# EAGLE design ArduinoMicroShield1.0v (EAGLE 7.2.0)
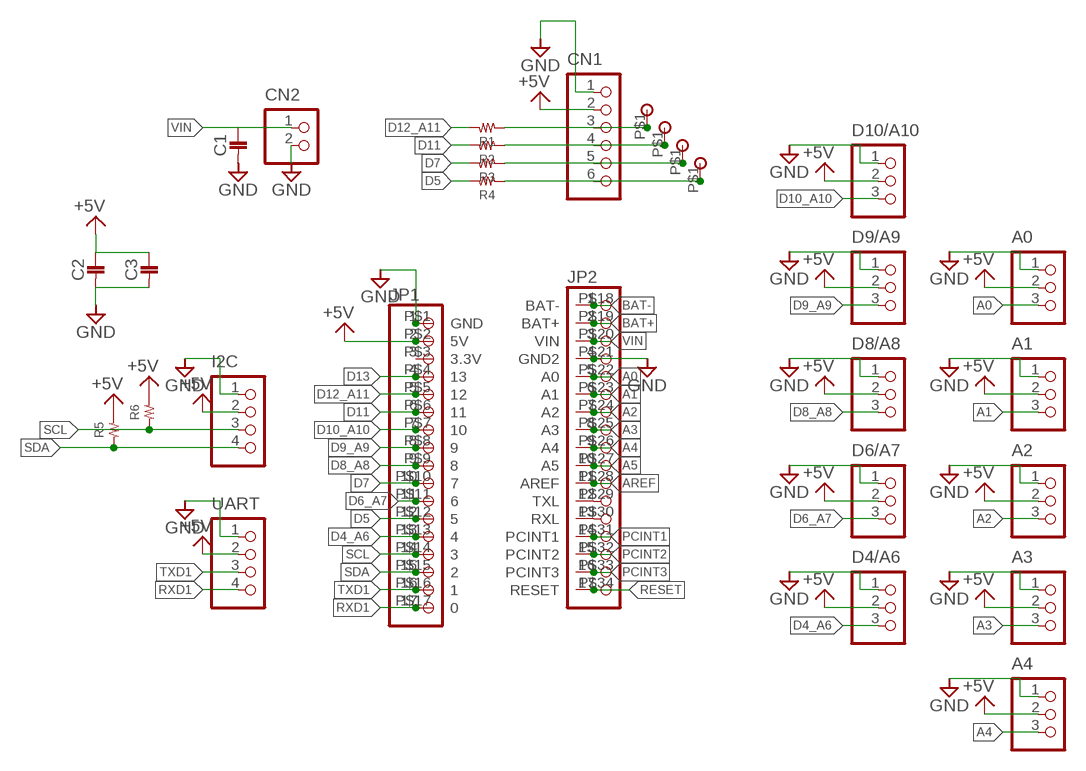
[diagram p0: schematic, sheet 1]

## Parts
A0  B3B-PH-K-S  [B3B-PH-K-S]
A1  B3B-PH-K-S  [B3B-PH-K-S]
A2  B3B-PH-K-S  [B3B-PH-K-S]
A3  B3B-PH-K-S  [B3B-PH-K-S]
A4  B3B-PH-K-S  [B3B-PH-K-S]
C1  1608  [1608]
C2  1608  [1608]
C3  1608  [1608]
CN1  B6B-PH-K-S  [B6B-PH-K-S]
CN2  S2B-PH-K-S  [S2B-PH-K-S]
D4/A6  B3B-PH-K-S  [B3B-PH-K-S]
D6/A7  B3B-PH-K-S  [B3B-PH-K-S]
D8/A8  B3B-PH-K-S  [B3B-PH-K-S]
D9/A9  B3B-PH-K-S  [B3B-PH-K-S]
D10/A10  B3B-PH-K-S  [B3B-PH-K-S]
I2C  B4B-PH-K-S  [B4B-PH-K-S]
JP1  PINHD-1X17  [1X17]
JP2  PINHD-1X17  [1X17]
R1  RESISTOR__SMD  [1608]
R2  RESISTOR__SMD  [1608]
R3  RESISTOR__SMD  [1608]
R4  RESISTOR__SMD  [1608]
R5  RESISTOR__SMD  [1608]
R6  RESISTOR__SMD  [1608]
U$1  ARDUINO_ASTAR_MICRO  [ARDUINO_ASTAR_MICRO]
U$31  CHECK_0.8MM  [CHECK_0.8MM]
U$32  CHECK_0.8MM  [CHECK_0.8MM]
U$36  CHECK_0.8MM  [CHECK_0.8MM]
U$37  CHECK_0.8MM  [CHECK_0.8MM]
UART  B4B-PH-K-S  [B4B-PH-K-S]

## Nets
+5V: A0.2 A1.2 A2.2 A3.2 A4.2 C2.P$1 C3.P$1 CN1.2 D4/A6.2 D6/A7.2 D8/A8.2 D9/A9.2 D10/A10.2 I2C.2 JP1.2 R5.2 R6.2 U$1.P$2(5V) UART.2
A0: A0.3 JP2.5 U$1.P$22(A0)
A1: A1.3 JP2.6 U$1.P$23(A1)
A2: A2.3 JP2.7 U$1.P$24(A2)
A3: A3.3 JP2.8 U$1.P$25(A3)
A4: A4.3 JP2.9 U$1.P$26(A4)
A5: JP2.10 U$1.P$27(A5)
AREF: JP2.11 U$1.P$28(AREF)
BAT+: JP2.2 U$1.P$19(BAT+)
BAT-: JP2.1 U$1.P$18(BAT-)
D4_A6: D4/A6.3 JP1.13 U$1.P$13
D5: JP1.12 R4.2 U$1.P$12
D6_A7: D6/A7.3 JP1.11 U$1.P$11
D7: JP1.10 R3.2 U$1.P$10
D8_A8: D8/A8.3 JP1.9 U$1.P$9
D9_A9: D9/A9.3 JP1.8 U$1.P$8
D10_A10: D10/A10.3 JP1.7 U$1.P$7
D11: JP1.6 R2.2 U$1.P$6
D12_A11: JP1.5 R1.2 U$1.P$5
D13: JP1.4 U$1.P$4
GND: A0.1 A1.1 A2.1 A3.1 A4.1 C1.P$2 C2.P$2 C3.P$2 CN1.1 CN2.2 D4/A6.1 D6/A7.1 D8/A8.1 D9/A9.1 D10/A10.1 I2C.1 JP1.1 JP2.4 U$1.P$1(GND) U$1.P$21(GND2) UART.1
N$1: CN1.6 R4.1 U$37.P$1
N$2: CN1.5 R3.1 U$36.P$1
N$3: CN1.4 R2.1 U$32.P$1
N$4: CN1.3 R1.1 U$31.P$1
N$5: JP1.3 U$1.P$3(3.3V)
N$6: JP2.12 U$1.P$29(TXL)
N$7: JP2.13 U$1.P$30(RXL)
PCINT1: JP2.14 U$1.P$31(PCINT1)
PCINT2: JP2.15 U$1.P$32(PCINT2)
PCINT3: JP2.16 U$1.P$33(PCINT3)
RESET: JP2.17 U$1.P$34(RESET)
RXD1: JP1.17 U$1.P$17 UART.4
SCL: I2C.3 JP1.14 R6.1 U$1.P$14
SDA: I2C.4 JP1.15 R5.1 U$1.P$15
TXD1: JP1.16 U$1.P$16 UART.3
VIN: C1.P$1 CN2.1 JP2.3 U$1.P$20(VIN)

## Library data of the parts
A0 A1-A4 D4/A6 D6/A7 D8/A8 D9/A9 D10/A10 = jst-ph:B3B-PH-*: Wire-to-Board 2.0mm pitch top mount connector Source: http://www.jst-mfg.com/product/pdf/jpn/PH.pdf http://www.jst-mfg.com/product/detail.php?series=199
C1-C3 = 02_C:1608
CN1 = jst-ph:B6B-PH-*: Wire-to-Board 2.0mm pitch top mount connector Source: http://www.jst-mfg.com/product/pdf/jpn/PH.pdf http://www.jst-mfg.com/product/detail.php?series=199
CN2 = jst-ph:S2B-PH-*: Wire-to-Board 2.0mm pitch side mount connector Source: http://www.jst-mfg.com/product/pdf/jpn/PH.pdf http://www.jst-mfg.com/product/detail.php?series=199
I2C UART = jst-ph:B4B-PH-*: Wire-to-Board 2.0mm pitch top mount connector Source: http://www.jst-mfg.com/product/pdf/jpn/PH.pdf http://www.jst-mfg.com/product/detail.php?series=199
JP1 JP2 = pinhead:PINHD-1X17: PIN HEADER
R1-R6 = 01_R:RESISTOR__SMD
U$1 = 04_IC:ARDUINO_ASTAR_MICRO
U$31 U$32 U$36 U$37 = 08_CONECTOR:CHECK_0.8MM

## Board
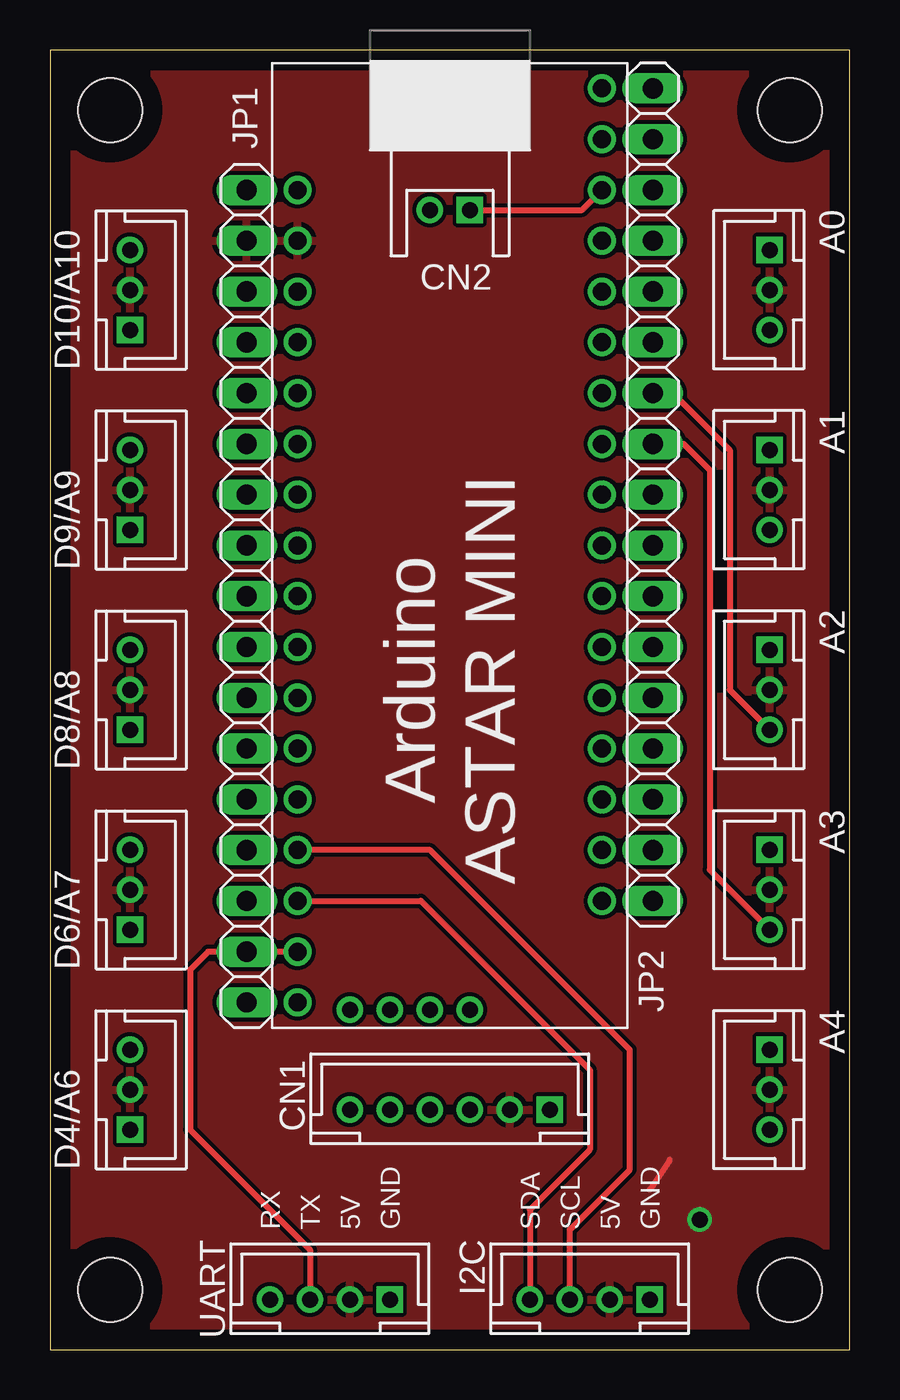
[diagram p1: board, top side]
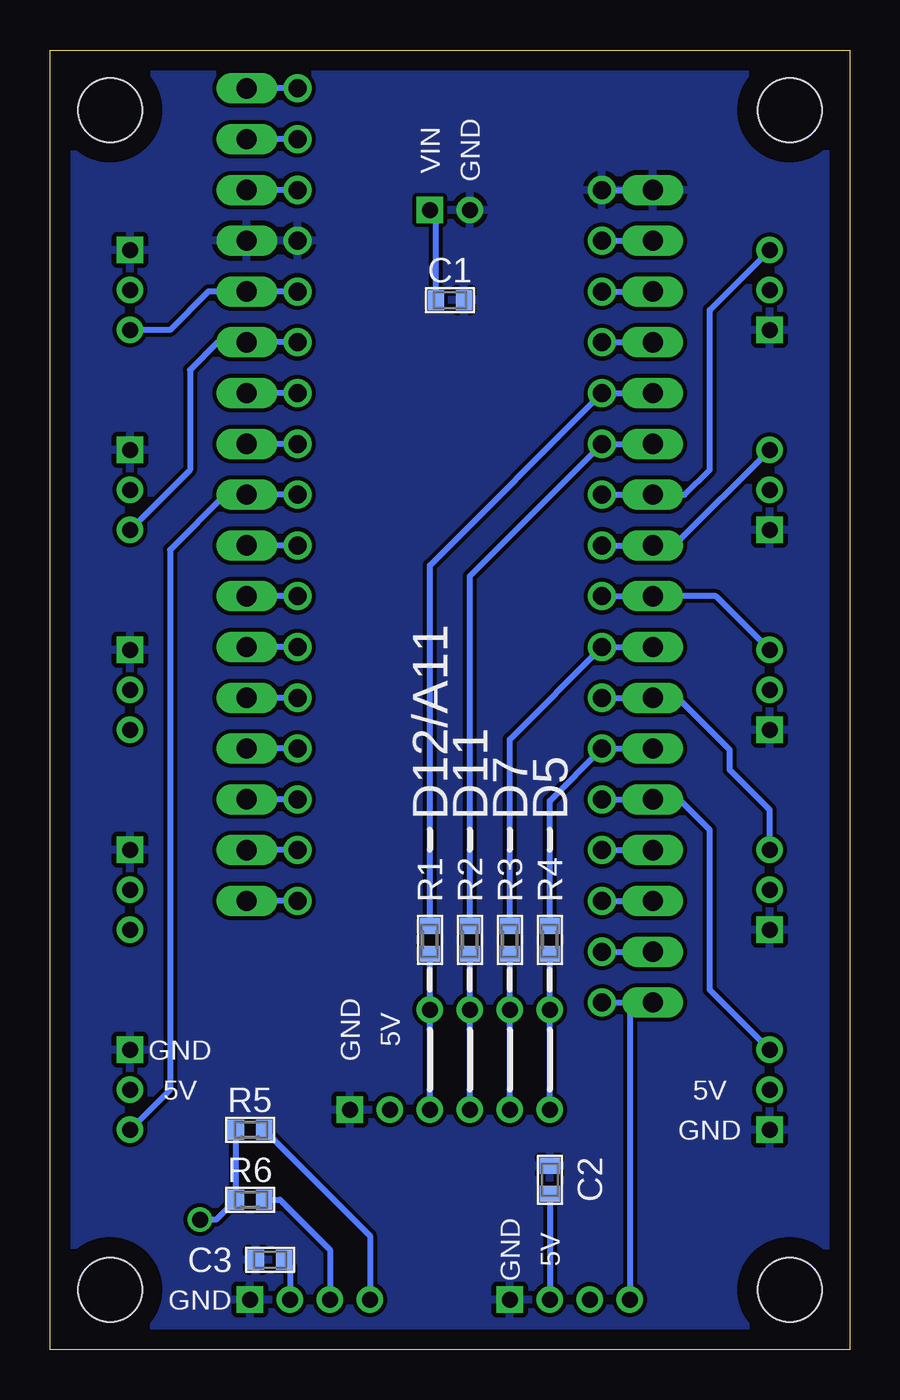
[diagram p2: board, bottom side, seen from below]

Size 40 x 65 mm. Coordinates in mm from the lower left corner, seen from the top.
Outline: 0,0 40,0 40,65 0,65 0,0
Copper layers (1*16): Top 0.035mm / dielectric 1.5mm / Bottom 0.035mm
Design rules "default": minimum track width 10mil, minimum drill 24mil, track to track 8mil, track to pad 8mil, pad to pad 8mil, via to via 8mil, smd to smd 8mil, copper to edge 40mil, drill to drill 8mil, minimum pad ring 10mil, minimum via ring 8mil, stop-mask expansion 4mil, vias tented up to drill 0mil, thermal gap 10mil
Holes 3.2 mm at 3,62 37,62 37,3 3,3

### Footprints (pad centres in the part's own frame; a part is rotated, then mirrored left to right if it is on the bottom)
B3B-PH-K-S = drill 0.8 square: 1 -2,0 | drill 0.8: 2 0,0; 3 2,0
1608 = smd 0.8 x 1: P$1 -0.7,0; P$2 0.7,0
B6B-PH-K-S = drill 0.8 square: 1 -5,0 | drill 0.8: 2 -3,0; 3 -1,0; 4 1,0; 5 3,0; 6 5,0
S2B-PH-K-S = drill 0.8 square: 1 1,0 | drill 0.8: 2 -1,0
B4B-PH-K-S = drill 0.8 square: 1 -3,0 | drill 0.8: 2 -1,0; 3 1,0; 4 3,0
1X17 = drill 1.016 long: 1 -20.32,0; 2 -17.78,0; 3 -15.24,0; 4 -12.7,0; 5 -10.16,0; 6 -7.62,0; 7 -5.08,0; 8 -2.54,0; 9 0,0; 10 2.54,0; 11 5.08,0; 12 7.62,0; 13 10.16,0; 14 12.7,0; 15 15.24,0; 16 17.78,0; 17 20.32,0
1608' = smd 0.8 x 1: 1 -0.7,0; 2 0.7,0
ARDUINO_ASTAR_MICRO = drill 0.9: P$1 -7.62,0; P$2 -7.62,-2.54; P$3 -7.62,-5.08; P$4 -7.62,-7.62; P$5 -7.62,-10.16; P$6 -7.62,-12.7; P$7 -7.62,-15.24; P$8 -7.62,-17.78; P$9 -7.62,-20.32; P$10 -7.62,-22.86; P$11 -7.62,-25.4; P$12 -7.62,-27.94; P$13 -7.62,-30.48; P$14 -7.62,-33.02; P$15 -7.62,-35.56; P$16 -7.62,-38.1; P$17 -7.62,-40.64; P$18 7.62,5.08; P$19 7.62,2.54; P$20 7.62,0; P$21 7.62,-2.54; P$22 7.62,-5.08; P$23 7.62,-7.62; P$24 7.62,-10.16; P$25 7.62,-12.7; P$26 7.62,-15.24; P$27 7.62,-17.78; P$28 7.62,-20.32; P$29 7.62,-22.86; P$30 7.62,-25.4; P$31 7.62,-27.94; P$32 7.62,-30.48; P$33 7.62,-33.02; P$34 7.62,-35.56
CHECK_0.8MM = drill 0.8: P$1 0,0

### Placement (x,y rotation side)
A0  36,53 270 top
A1  36,43 270 top
A2  36,33 270 top
A3  36,23 270 top
A4  36,13 270 top
C1  20,52.5 0 bottom
C2  15,8.5 90 bottom
C3  29,4.5 180 bottom
CN1  20,12 180 top
CN2  20,57 0 top
D4/A6  4,13 90 top
D6/A7  4,23 90 top
D8/A8  4,33 90 top
D9/A9  4,43 90 top
D10/A10  4,53 90 top
DRILEGEND  [DRILEGEND]  -1.2,-22.01 0 top  (outside the outline)
I2C  27,2.5 180 top
JP1  9.84,37.68 270 top
JP2  30.16,42.76 270 top
R1  [1608']  21,20.5 90 bottom
R2  [1608']  19,20.5 90 bottom
R3  [1608']  17,20.5 90 bottom
R4  [1608']  15,20.5 90 bottom
R5  [1608']  30,11 180 bottom
R6  [1608']  30,7.5 180 bottom
U$1  20,58 0 top
U$31  21,17 0 top
U$32  19,17 0 top
U$36  17,17 0 top
U$37  15,17 0 top
UART  14,2.5 180 top

### Tracks (layer width: path | path; a pad name or v marks a point on that pad's centre or on a via)
+5V  (via drill 0.8)
  Top 0.3: 31,9.5 30,8 | v32.5,6.5 32.5,7
  Bottom 0.3: U$1.P$2 JP1.2 | C3.P$1 28,4.2 I2C.2 | C2.P$1 UART.2 | R5.2 R6.2 31.7,6.5 v32.5,6.5
  pour Top: 0,65 40,65 40,0 0,0
A0
  Bottom 0.3: A0.3 34,51 32.08,52.92 31,52.92 JP2.5 U$1.P$22
A1
  Bottom 0.3: A1.3 33,44 33,49 31.62,50.38 JP2.6 U$1.P$23
A2
  Top 0.3: JP2.7 31.16,47.84 34,45 34,33 A2.3
  Bottom 0.3: U$1.P$24 JP2.7
A3
  Top 0.3: JP2.8 31.7,45.3 33,44 33,24 A3.3
  Bottom 0.3: U$1.P$25 JP2.8
A4
  Bottom 0.3: A4.3 34,13 34,40 31.24,42.76 JP2.9 U$1.P$26
A5
  Bottom 0.3: U$1.P$27 JP2.10
AREF
  Bottom 0.3: U$1.P$28 JP2.11
BAT+
  Bottom 0.3: U$1.P$19 JP2.2
BAT-
  Bottom 0.3: U$1.P$18 JP2.1
D4_A6
  Bottom 0.3: U$1.P$13 JP1.13 8.52,27.52 7,26 7,18 D4/A6.3
D5
  Bottom 0.3: R4.2 15,27.44 U$1.P$12 JP1.12
D6_A7
  Bottom 0.3: U$1.P$11 JP1.11 8.6,32.6 6,30 6,29 4,27 D6/A7.3
D7
  Bottom 0.3: R3.2 17,30.52 U$1.P$10 JP1.10
D8_A8
  Bottom 0.3: U$1.P$9 JP1.9 6.68,37.68 D8/A8.3
D9_A9
  Bottom 0.3: U$1.P$8 JP1.8 8.78,40.22 D9/A9.3
D10_A10
  Bottom 0.3: U$1.P$7 JP1.7 8.24,42.76 7,44 7,52 D10/A10.3
D11
  Bottom 0.3: R2.2 19,38.68 U$1.P$6 JP1.6
D12_A11
  Bottom 0.3: R1.2 21,39.22 U$1.P$5 JP1.5
D13
  Bottom 0.3: U$1.P$4 JP1.4
GND
  Bottom 0.3: U$1.P$1 JP1.1
  pour Bottom: -1,66 41,66 41,-1 -1,-1
N$1
  Bottom 0.3: CN1.6 U$37.P$1 R4.1
N$2
  Bottom 0.3: CN1.5 U$36.P$1 R3.1
N$3
  Bottom 0.3: CN1.4 U$32.P$1 R2.1
N$4
  Bottom 0.3: CN1.3 U$31.P$1 R1.1
N$5
  Bottom 0.3: U$1.P$3 JP1.3
N$6
  Bottom 0.3: U$1.P$29 JP2.12
N$7
  Bottom 0.3: U$1.P$30 JP2.13
PCINT1
  Bottom 0.3: U$1.P$31 JP2.14
PCINT2
  Bottom 0.3: U$1.P$32 JP2.15
PCINT3
  Bottom 0.3: U$1.P$33 JP2.16
RESET
  Bottom 0.3: U$1.P$34 JP2.17
RXD1
  Bottom 0.3: U$1.P$17 11,17.36 | 11,17.36 JP1.17 | 11,17.36 UART.4
SCL
  Top 0.3: I2C.3 26,6 29,9 29,15 19.02,24.98 U$1.P$14
  Bottom 0.3: U$1.P$14 JP1.14 | R6.1 28.5,7.5 26,5 I2C.3
SDA
  Top 0.3: U$1.P$15 18.56,22.44 27,14 27,10 24,7 I2C.4
  Bottom 0.3: U$1.P$15 JP1.15 | R5.1 24,5.7 I2C.4
TXD1
  Top 0.3: U$1.P$16 7.9,19.9 7,19 7,11 13,5 UART.3
  Bottom 0.3: U$1.P$16 JP1.16
VIN
  Top 0.3: CN2.1 26.62,57 U$1.P$20
  Bottom 0.3: U$1.P$20 JP2.3 | C1.P$1 20.7,56.7 CN2.1

### Text on the board
tPlace: Arduino | ASTAR MINI | RX | TX | 5V | GND | SDA | SCL | 5V | GND
bPlace: GND | VIN | D5 | D7 | D11 | D12/A11 | 5V | GND | GND | 5V | 5V | GND | 5V | GND | GND
Measures: 穴図